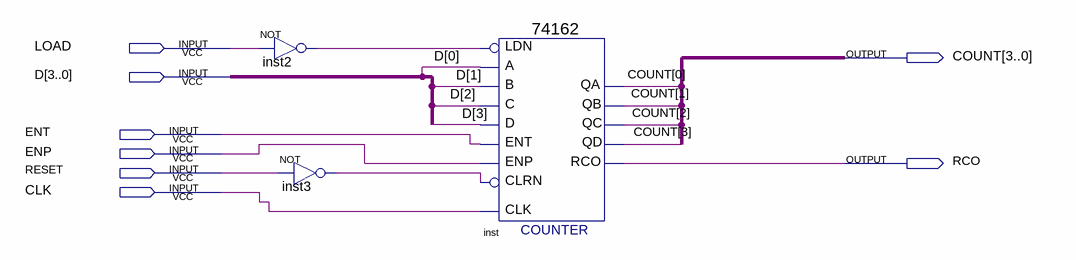
[diagram p0: schematic sheet]
// Quartus schematic counter_bcd.bdf as structural Verilog: 3 symbols, 8 pins
module counter_bcd (
  input  LOAD,
  input  [3:0] D,
  input  ENT,
  input  ENP,
  input  RESET,
  input  CLK,
  output [3:0] COUNT,
  output RCO
);

  wire inst2_out, inst3_out;

  not inst2 (inst2_out, LOAD);
  not inst3 (inst3_out, RESET);
  \74162  inst (
    .A(D[0]), .LDN(inst2_out), .B(D[1]), .C(D[2]), .D(D[3]), .ENP(ENP), .ENT(ENT), .CLRN(inst3_out),
    .CLK(CLK), .QA(COUNT[0]), .QB(COUNT[1]), .QC(COUNT[2]), .QD(COUNT[3]), .RCO(RCO));
endmodule
